# Altium schematic sheet FireFlow.SchDoc
size A4; Organization: Altium Limited; Address1: L3, 12a Rodborough Rd; Address2: Frenchs Forest; Address3: NSW; Address4: Australia 2086
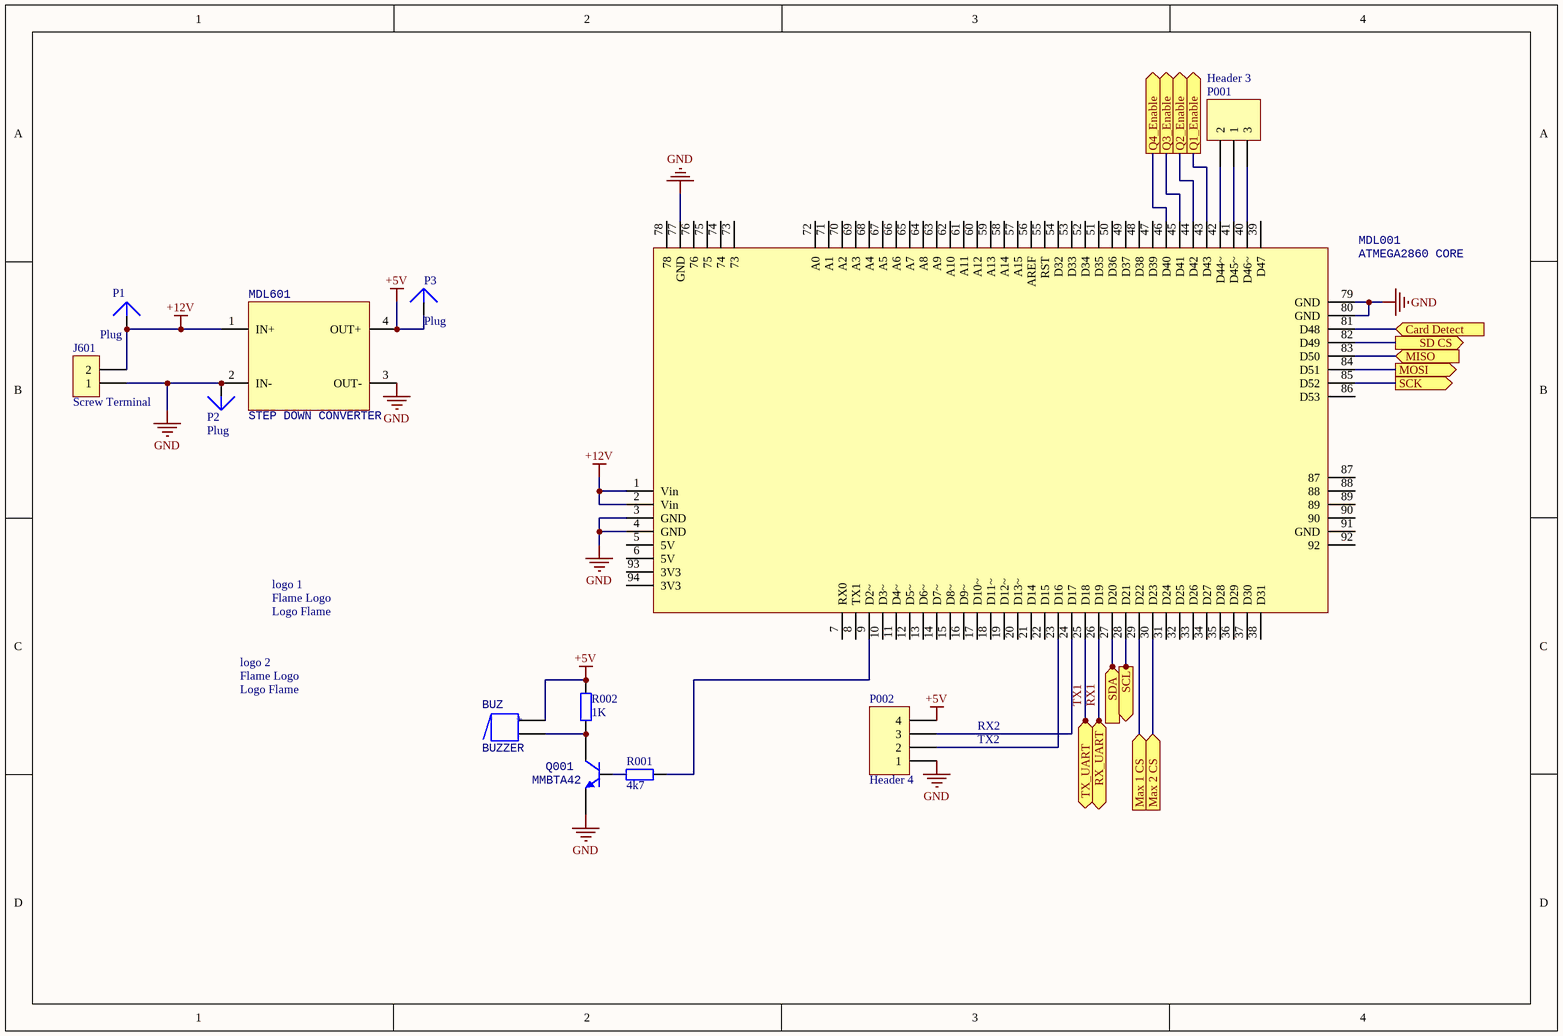
[diagram p0: FireFlow.SchDoc]

## Parts
BUZ  BUZZER  [BUZZER]
J601  Screw Terminal  [2pin ST]
logo_1  Logo Flame  [LogoF Top OL]
logo_2  Logo Flame  [LogoF Top OL]
MDL001  ATMEGA2860 CORE  [ATMEGA 2560 CORE]
MDL601  STEP DOWN CONVERTER  [STEP DOWN CONVERTER MINI]
P1  Plug  [PIN1]
P001  Header 3  [HDR1X3]
P2  Plug  [PIN1]
P002  Header 4  [HDR1X4]
P3  Plug  [PIN1]
Q001  MMBTA42  [SO-G3]
R001  4k7  [CR2012-0805]
R002  1K  [CR2012-0805]

## Ports
Card Detect (in), Max 1 CS (in), Max 2 CS (in), MISO (in), MOSI (out), Q1_Enable (out), Q2_Enable (out), Q3_Enable (out), Q4_Enable (out), RX_UART, SCK (out), SCL (out), SD CS (out), SDA (in), TX_UART

## Nets
+5V: BUZ.1 MDL601.4(OUT+) P002.4 P3.1 R002.1
+12V: J601.2 MDL001.1(Vin) MDL001.2(Vin) MDL601.1(IN+) P1.1
GND: J601.1 MDL001.3(GND) MDL001.4(GND) MDL001.77(GND) MDL001.79(GND) MDL001.80(GND) MDL601.2(IN-) MDL601.3(OUT-) P2.1 P002.1 Q001.2(E)
Card Detect: MDL001.81(D48) ; port Card Detect
Max 1 CS: MDL001.29(D22) ; port Max 1 CS
Max 2 CS: MDL001.30(D23) ; port Max 2 CS
MISO: MDL001.83(D50) ; port MISO
MOSI: MDL001.84(D51) ; port MOSI
Q1_Enable: MDL001.43(D43) ; port Q1_Enable
Q2_Enable: MDL001.44(D42) ; port Q2_Enable
Q3_Enable: MDL001.45(D41) ; port Q3_Enable
Q4_Enable: MDL001.46(D40) ; port Q4_Enable
RX1: MDL001.26(D19) ; port RX_UART
SCK: MDL001.85(D52) ; port SCK
SCL: MDL001.28(D21) ; port SCL
SD CS: MDL001.82(D49) ; port SD CS
SDA: MDL001.27(D20) ; port SDA
TX1: MDL001.25(D18) ; port TX_UART
NetBUZ_2: BUZ.2 Q001.3(C) R002.2
NetMDL001_9: MDL001.9(D2~) R001.1
NetMDL001_23: MDL001.23(D16) P002.2
NetMDL001_24: MDL001.24(D17) P002.3
NetMDL001_40: MDL001.40(D46~) P001.3
NetMDL001_41: MDL001.41(D45~) P001.1
NetMDL001_42: MDL001.42(D44~) P001.2
NetQ001_1: Q001.1(B) R001.2

Not connected (* = marked no-connect by the designer): MDL001 5(5V) 6(5V) 7(RX0) 8(TX1) 10(D3~) 11(D4~) 12(D5~) 13(D6~) 14(D7~) 15(D8~) 16(D9~) 17(D10~) 18(D11~) 19(D12~) 20(D13~) 21(D14) 22(D15) 31(D24) 32(D25) 33(D26) 34(D27) 35(D28) 36(D29) 37(D30) 38(D31) 39(D47) 47(D39) 48(D38) 49(D37) 50(D36) 51(D35) 52(D34) 53(D33) 54(D32) 55(RST) 56(AREF) 57(A15) 58(A14) 59(A13) 60(A12) 61(A11) 62(A10) 63(A9) 64(A8) 65(A7) 66(A6) 67(A5) 68(A4) 69(A3) 70(A2) 71(A1) 72(A0) 73 74 75 76 78 86(D53) 87 88 89 90 91(GND) 92 93(3V3) 94(3V3)

## Notes on the sheet
- RX2
- TX2
- (in symbol BUZZER) +
- (in symbol Logo Flame) Flame Logo

## Library data of the parts
J601 = 2 pin Screw Terminal: WR-TBL Terminal block - serie 102 - 5.0mm; ComponentLink2 Description: Datasheet; NoPins: 2; ComponentLink2URL: http://katalog.we-online.de/em/datasheet/6911027100xx.pdf
MDL001 = ATMEGA2560 CORE
P001 = Header 3: Header, 3-Pin; LatestRevisionDate: 17-Jul-2002; LatestRevisionNote: Re-released for DXP Platform.; Publisher: Altium Limited
P002 = Header 4: Header, 4-Pin; LatestRevisionDate: 17-Jul-2002; LatestRevisionNote: Re-released for DXP Platform.; Publisher: Altium Limited
Q001 = MMBTA42: NPN Bipolar Transistor; Published: 8-Jun-2000; LatestRevisionDate: 17-Jul-2002; LatestRevisionNote: Re-released for DXP Platform.; PackageReference: TO-226; Publisher: Altium Limited; Code_JEDEC: TO-226-AA
R001 R002 = Resistor
  R001: Value: 4k7
  R002: Value: 1K
P1-P3 = Plug: LatestRevisionDate: 17-Jul-2002; LatestRevisionNote: Re-released for DXP Platform.; Publisher: Altium Limited